# Altium project Demo.PrjPcb
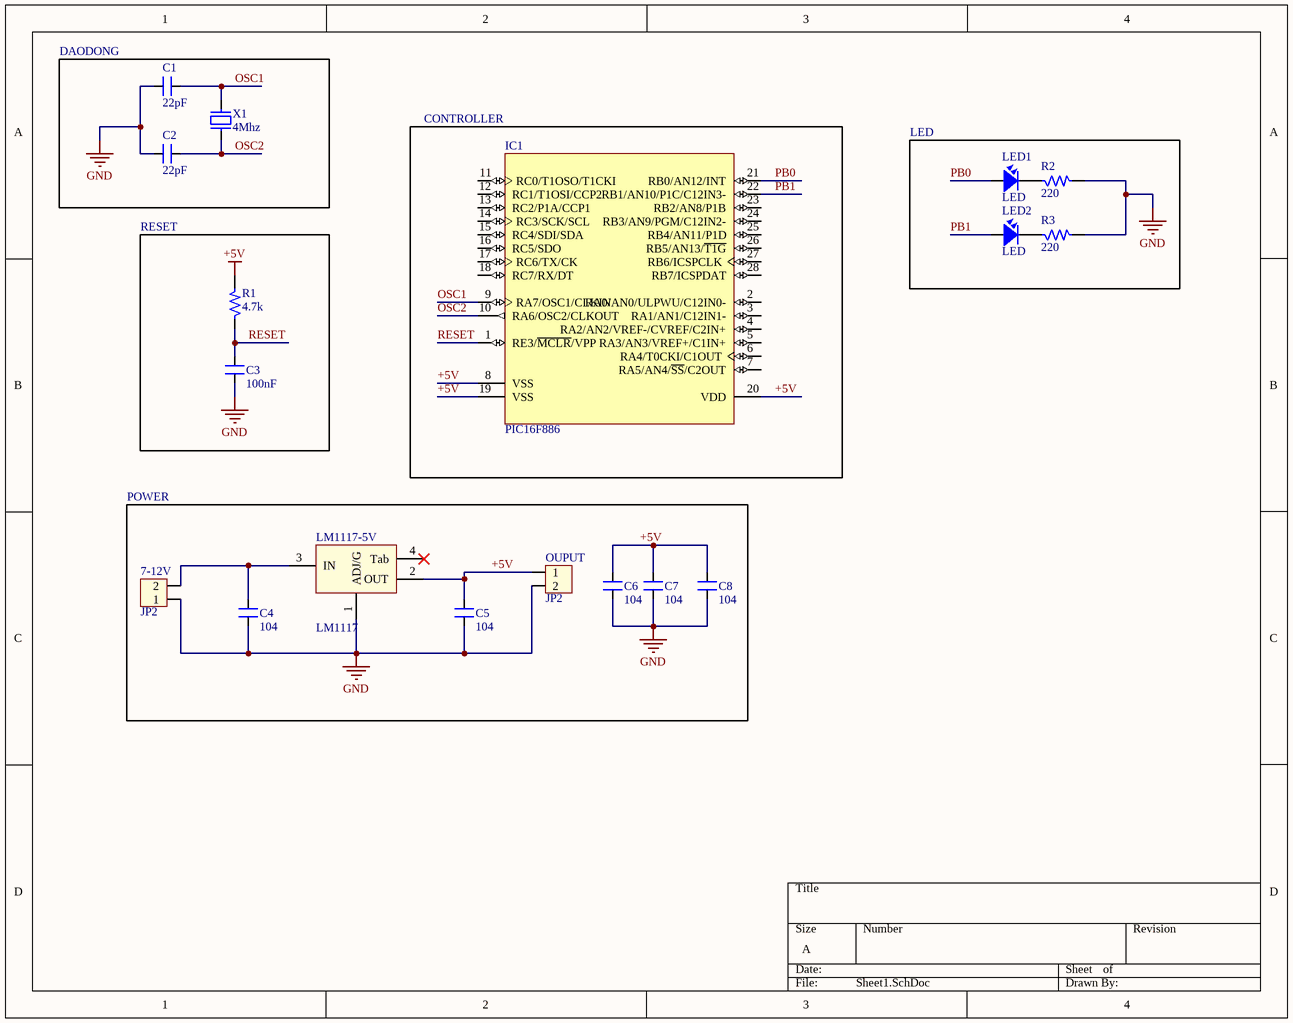
[diagram p0: Sheet1.SchDoc]
1 sheet, 18 parts. Net scope: global (net labels, ports and power ports of the same name join across sheets).
Board files: PCB1.PcbDoc, PCB2.PcbDoc, PCB3.PcbDoc

## Sheet Sheet1.SchDoc
size A

### Parts
7-12V  JP2  [CON2]
C1  22pF  [CN1]
C2  22pF  [CN1]
C3  100nF  [SM-0805]
C4  104  [SM-0805]
C5  104  [SM-0805]
C6  104  [CN4]
C7  104  [CN4]
C8  104  [CN4]
IC1  PIC16F886  [DIP28/W0.3]
LED1  LED  [LED-3]
LED2  LED  [LED-3]
LM1117-5V  LM1117  [SOT223-4N]
OUPUT  JP2  [CON2]
R1  4.7k  [R1/4W]
R2  220  [R1/4W]
R3  220  [R1/4W]
X1  4Mhz  [XT2]

### Blocks framed on the sheet
DAODONG: C1 C2 X1
CONTROLLER: IC1
LED: LED1 LED2 R2 R3
RESET: C3 R1
POWER: 7-12V C4-C8 LM1117-5V OUPUT

### Nets
+5V: C5.2 C6.2 C7.2 C8.2 IC1.8(VSS) IC1.19(VSS) IC1.20(VDD) LM1117-5V.2(OUT) OUPUT.1 R1.2
GND: 7-12V.1 C1.1 C2.1 C3.1 C4.1 C5.1 C6.1 C7.1 C8.1 LM1117-5V.1(ADJ/G) OUPUT.2 R2.2 R3.2
OSC1: C1.2 IC1.9(RA7/OSC1/CLKIN) X1.1
OSC2: C2.2 IC1.10(RA6/OSC2/CLKOUT) X1.2
PB0: IC1.21(RB0/AN12/INT) LED1.1
PB1: IC1.22(RB1/AN10/P1C/C12IN3-) LED2.1
RESET: C3.2 IC1.1(RE3/~{MCLR}/VPP) R1.1
Net7-12V_2: 7-12V.2 C4.2 LM1117-5V.3(IN)
NetLED1_2: LED1.2 R2.1
NetLED2_2: LED2.2 R3.1

Not connected (* = marked no-connect by the designer): IC1 2(RA0/AN0/ULPWU/C12IN0-) 3(RA1/AN1/C12IN1-) 4(RA2/AN2/VREF-/CVREF/C2IN+) 5(RA3/AN3/VREF+/C1IN+) 6(RA4/T0CKI/C1OUT) 7(RA5/AN4/~{SS}/C2OUT) 11(RC0/T1OSO/T1CKI) 12(RC1/T1OSI/CCP2) 13(RC2/P1A/CCP1) 14(RC3/SCK/SCL) 15(RC4/SDI/SDA) 16(RC5/SDO) 17(RC6/TX/CK) 18(RC7/RX/DT) 23(RB2/AN8/P1B) 24(RB3/AN9/PGM/C12IN2-) 25(RB4/AN11/P1D) 26(RB5/AN13/~{T1G}) 27(RB6/ICSPCLK) 28(RB7/ICSPDAT); LM1117-5V 4(Tab)*

### Library data of the parts
7-12V OUPUT = Con2: Connector 2; Value: Connector 2
C1 C2 = CN1: Cap np  1pF - 472pF; Value: 100pF
C3-C5 = CM: Cap SMD; Value: 103
C6-C8 = CN4: Cap np W0.4; Value: 0.47uF
IC1 = PIC16F886: 8-Bit CMOS FLASH Microcontroller, 8K x 14 words FLASH, 368 x 8 Bytes RAM, 4 MHz, 28-Pin PDIP 300mil, 4 to 5.5V VDD Range, Commercial Temperature
LED1 LED2 = LED: LED Single colour Green and Red; Value: LED 3 ly Single Colour
LM1117-5V = LM1117: 3v3; Value: LM317
R1-R3 = R: Resistor 1/4W; Value: R1/4W - 1K
X1 = XT2: Crystal For all Crystal 2pin.; Value: 4Mhz